# Altium schematic sheet inOpto.SchDoc
size A
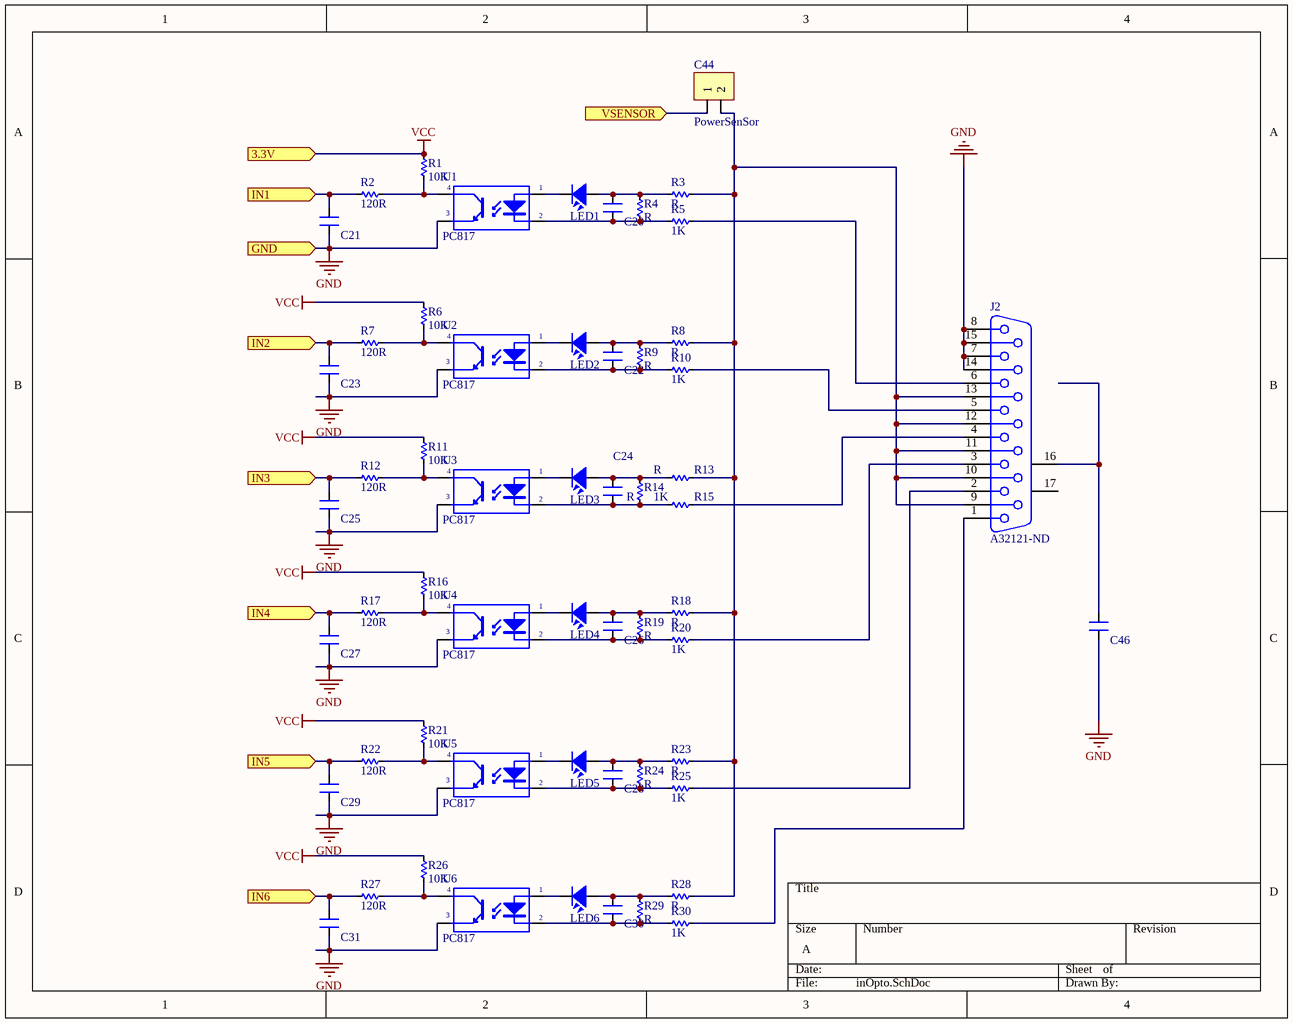
[diagram p0: inOpto.SchDoc]

## Parts
C20  CN  [CN-SMD-0603_big]  (value not drawn)
C21  CN  [CN-SMD-0603_big]  (value not drawn)
C22  CN  [CN-SMD-0603_big]  (value not drawn)
C23  CN  [CN-SMD-0603_big]  (value not drawn)
C24  CN  [CN-SMD-0603_big]  (value not drawn)
C25  CN  [CN-SMD-0603_big]  (value not drawn)
C26  CN  [CN-SMD-0603_big]  (value not drawn)
C27  CN  [CN-SMD-0603_big]  (value not drawn)
C28  CN  [CN-SMD-0603_big]  (value not drawn)
C29  CN  [CN-SMD-0603_big]  (value not drawn)
C30  CN  [CN-SMD-0603_big]  (value not drawn)
C31  CN  [CN-SMD-0603_big]  (value not drawn)
C44  PowerSenSor  [JP2-CLOSED]
C46  CN  [CN-SMD-0603_big]  (value not drawn)
J2  A32121-ND  [DB15]
LED1  MinZ  [LED-0805-Blue]  (value not drawn)
LED2  MinZ  [LED-0805-Blue]  (value not drawn)
LED3  MinZ  [LED-0805-Blue]  (value not drawn)
LED4  MinZ  [LED-0805-Blue]  (value not drawn)
LED5  MinZ  [LED-0805-Blue]  (value not drawn)
LED6  MinZ  [LED-0805-Blue]  (value not drawn)
R1  10K  [RES-SMD-0603_BIG]
R2  120R  [RES-SMD-0603_BIG]
R3  R  [RES-SMD-0603_BIG]
R4  R  [RES-SMD-0603_BIG]
R5  1K  [RES-SMD-0603_BIG]
R6  10K  [RES-SMD-0603_BIG]
R7  120R  [RES-SMD-0603_BIG]
R8  R  [RES-SMD-0603_BIG]
R9  R  [RES-SMD-0603_BIG]
R10  1K  [RES-SMD-0603_BIG]
R11  10K  [RES-SMD-0603_BIG]
R12  120R  [RES-SMD-0603_BIG]
R13  R  [RES-SMD-0603_BIG]
R14  R  [RES-SMD-0603_BIG]
R15  1K  [RES-SMD-0603_BIG]
R16  10K  [RES-SMD-0603_BIG]
R17  120R  [RES-SMD-0603_BIG]
R18  R  [RES-SMD-0603_BIG]
R19  R  [RES-SMD-0603_BIG]
R20  1K  [RES-SMD-0603_BIG]
R21  10K  [RES-SMD-0603_BIG]
R22  120R  [RES-SMD-0603_BIG]
R23  R  [RES-SMD-0603_BIG]
R24  R  [RES-SMD-0603_BIG]
R25  1K  [RES-SMD-0603_BIG]
R26  10K  [RES-SMD-0603_BIG]
R27  120R  [RES-SMD-0603_BIG]
R28  R  [RES-SMD-0603_BIG]
R29  R  [RES-SMD-0603_BIG]
R30  1K  [RES-SMD-0603_BIG]
U1  PC817  [PC817SMT]
U2  PC817  [PC817SMT]
U3  PC817  [PC817SMT]
U4  PC817  [PC817SMT]
U5  PC817  [PC817SMT]
U6  PC817  [PC817SMT]

## Ports
3.3V (in), GND (in), IN1 (in), IN2 (in), IN3 (in), IN4 (in), IN5 (in), IN6 (in), VSENSOR (in)

## Nets
GND: C21.1 C23.1 C25.1 C27.1 C29.1 C31.1 C46.1 J2.7 J2.8 J2.14 J2.15 U1.3(E) U2.3(E) U3.3(E) U4.3(E) U5.3(E) U6.3(E) ; port GND
VCC: R1.1 R6.1 R11.1 R16.1 R21.1 R26.1 ; port 3.3V
IN1: C21.2 R2.1 ; port IN1
IN2: C23.2 R7.1 ; port IN2
IN3: C25.2 R12.1 ; port IN3
IN4: C27.2 R17.1 ; port IN4
IN5: C29.2 R22.1 ; port IN5
IN6: C31.2 R27.1 ; port IN6
VSENSOR: C44.1 ; port VSENSOR
NetC20_1: C20.1 R4.2 R5.2 U1.2(K)
NetC20_2: C20.2 LED1.1 R3.2 R4.1
NetC22_1: C22.1 R9.2 R10.2 U2.2(K)
NetC22_2: C22.2 LED2.1 R8.2 R9.1
NetC24_1: C24.1 R14.2 R15.2 U3.2(K)
NetC24_2: C24.2 LED3.1 R13.2 R14.1
NetC26_1: C26.1 R19.2 R20.2 U4.2(K)
NetC26_2: C26.2 LED4.1 R18.2 R19.1
NetC28_1: C28.1 R24.2 R25.2 U5.2(K)
NetC28_2: C28.2 LED5.1 R23.2 R24.1
NetC30_1: C30.1 R29.2 R30.2 U6.2(K)
NetC30_2: C30.2 LED6.1 R28.2 R29.1
NetC44_2: C44.2 J2.9 J2.10 J2.11 J2.12 J2.13 R3.1 R8.1 R13.1 R18.1 R23.1 R28.1
NetC46_2: C46.2 J2.16(MH1)
NetJ2_1: J2.1 R30.1
NetJ2_2: J2.2 R25.1
NetJ2_3: J2.3 R20.1
NetJ2_4: J2.4 R15.1
NetJ2_5: J2.5 R10.1
NetJ2_6: J2.6 R5.1
NetLED1_2: LED1.2 U1.1(A)
NetLED2_2: LED2.2 U2.1(A)
NetLED3_2: LED3.2 U3.1(A)
NetLED4_2: LED4.2 U4.1(A)
NetLED5_2: LED5.2 U5.1(A)
NetLED6_2: LED6.2 U6.1(A)
NetR1_2: R1.2 R2.2 U1.4(C)
NetR6_2: R6.2 R7.2 U2.4(C)
NetR11_2: R11.2 R12.2 U3.4(C)
NetR16_2: R16.2 R17.2 U4.4(C)
NetR21_2: R21.2 R22.2 U5.4(C)
NetR26_2: R26.2 R27.2 U6.4(C)

Not connected (* = marked no-connect by the designer): J2 17(MH2)

## Library data of the parts
C20-C31 C46 = CN: Value: 33pF
C44 = JP2: WR-PHD 2.54 mm Angled Socket Header; Manufacturer: W¨¹rth Elektronik eiSos GmbH; partNo: 613002143121; ComponentLink1 Description: Manufacturer; ComponentLink2 Description: Datasheet; NoPins: 02; Created Date: 29 March 2013; ComponentLink1URL: http://www.we-online.com; ComponentLink2URL: http://katalog.we-online.de/em/datasheet/6130xx143121.pdf; Created by: Karrer Zheng
J2 = DB15: Receptacle Assembly, 15 Position, Right Angle; PackageDocument: O; Positions: 15; Published: 15-Jun-2001; LatestRevisionDate: 17-Jul-2002; LatestRevisionNote: Re-released for DXP Platform.; DatasheetDocument: 1-Sep-99; PackageReference: 788757; Publisher: Altium Limited; Orientation: Right Angle; Gender: Receptacle
LED1-LED6 = LED SMD: Value: LED 3 - 5 ly 2 Colour
R1 R2 R5-R7 R10-R12 R15-R17 R20-R22 R25-R27 R30 = R
U1-U6 = PC817: Single Opto; Value: PC817